# EAGLE design COM_R_UPDATED (EAGLE 9.6.2)
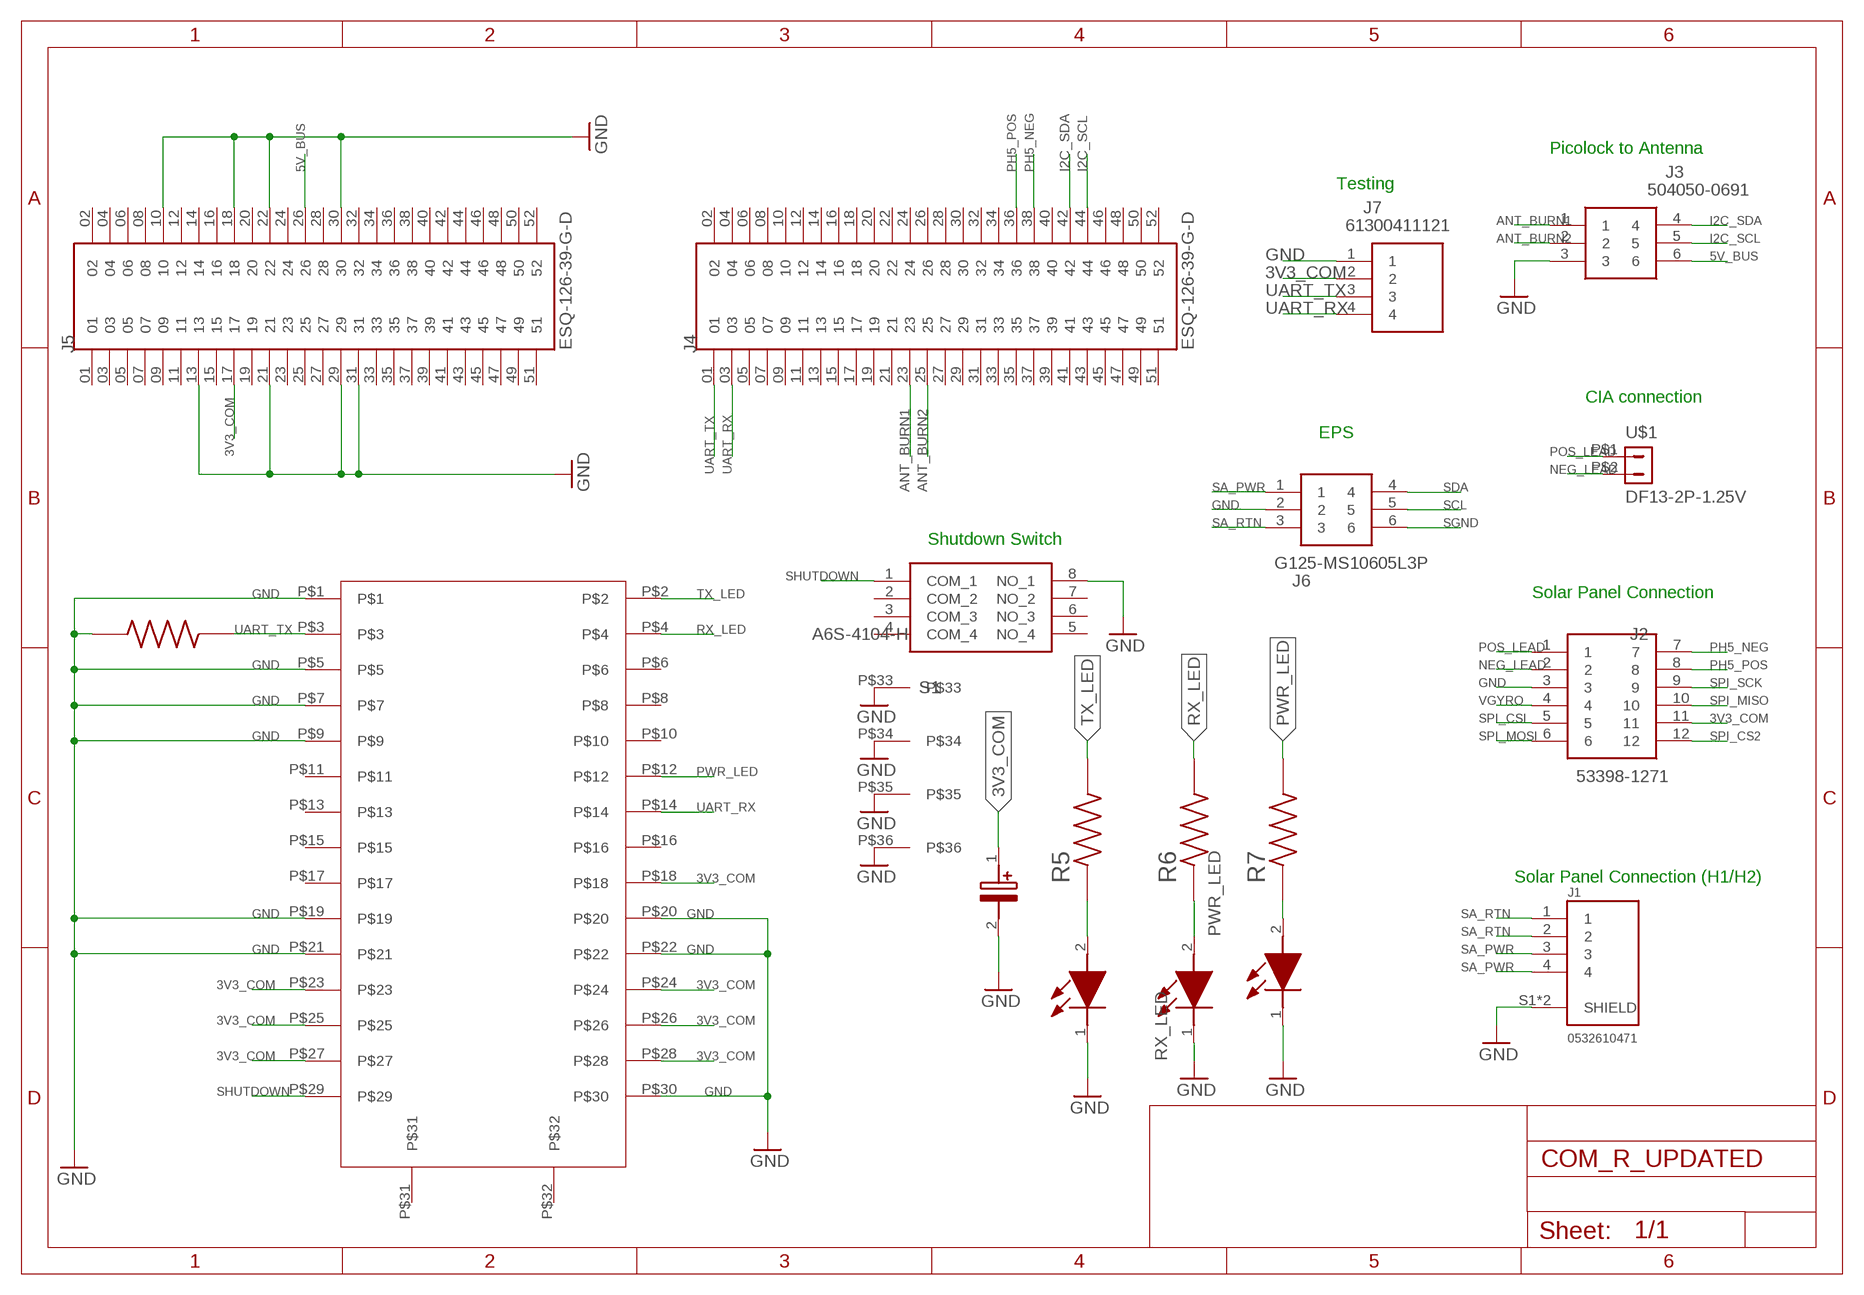
[diagram p0: schematic, sheet 1]

## Parts
C2  293D106X0010A2TE3  [CAPPM3216X180N]
J1  0532610471  [MOLEX_0532610471]
J2  53398-1271  [53398-1271]
J3  504050-0691  [504050-0691_2]
J4  ESQ-126-39-G-D  [SAMTEC_ESQ-126-39-G-D]
J5  ESQ-126-39-G-D  [SAMTEC_ESQ-126-39-G-D]
J6  G125-MS10605L3P  [G125-MS10605L3P]
J7  61300411121  [HDRV4W95P0X254_1X4_1016X254X85]
PWR_LED  HSMQ-C170-T0000  [LEDC2012X90N]
R3  TNPW080510K0BETY  [RESC2012X55N]
R5  Y40621K00000Q0R  [RESC2012X64N]
R6  Y40621K00000Q0R  [RESC2012X64N]
R7  Y40621K00000Q0R  [RESC2012X64N]
RX_LED  HSMQ-C170-T0000  [LEDC2012X90N]
S1  A6S-4104-H  [A6S4104H]
TX_LED  HSMQ-C170-T0000  [LEDC2012X90N]
U$1  DF13-2P-1.25V  [DF13C-2P-1.25V]
U$3  KYOCERA_5046_30PIN  [KYOCERA_5046_30PIN]

## Nets
3V3_COM: C2.1(+) J2.11 J5.17 J7.2 U$3.P$18 U$3.P$23 U$3.P$24 U$3.P$25 U$3.P$26 U$3.P$27 U$3.P$28
5V_BUS: J3.6 J5.26
ANT_BURN1: J3.1 J4.23
ANT_BURN2: J3.2 J4.25
GND [New Class]: C2.2(-) J1.S1(SHIELD) J1.S2(SHIELD) J2.3 J3.3 J5.10 J5.13 J5.18 J5.21 J5.22 J5.29 J5.30 J5.31 J6.2 J7.1 PWR_LED.1(K) R3.1 RX_LED.1(K) S1.8(NO_1) TX_LED.1(K) U$3.P$1 U$3.P$5 U$3.P$7 U$3.P$9 U$3.P$19 U$3.P$20 U$3.P$21 U$3.P$22 U$3.P$30 U$3.P$33 U$3.P$34 U$3.P$35 U$3.P$36
I2C_SCL: J3.5 J4.44
I2C_SDA: J3.4 J4.42
N$1: R5.1 TX_LED.2(A)
N$2: PWR_LED.2(A) R7.1
N$4: R6.1 RX_LED.2(A)
NEG_LEAD: J2.2 U$1.P$2
PH5_NEG: J2.7 J4.38
PH5_POS: J2.8 J4.36
POS_LEAD: J2.1 U$1.P$1
PWR_LED: R7.2 U$3.P$12
RX_LED: R6.2 U$3.P$4
SA_PWR: J1.3 J1.4 J6.1
SA_RTN: J1.1 J1.2 J6.3
SCL: J6.5
SDA: J6.4
SGND: J6.6
SHUTDOWN: S1.1(COM_1) U$3.P$29
SPI_CS2: J2.12
SPI_CSI: J2.5
SPI_MISO: J2.10
SPI_MOSI: J2.6
SPI_SCK: J2.9
TX_LED: R5.2 U$3.P$2
UART_RX: J4.03 J7.4 U$3.P$14
UART_TX: J4.01 J7.3 R3.2 U$3.P$3
VGYRO: J2.4
Unconnected: J4.02 J4.04 J4.05 J4.06 J4.07 J4.08 J4.09 J4.10 J4.11 J4.12 J4.13 J4.14 J4.15 J4.16 J4.17 J4.18 J4.19 J4.20 J4.21 J4.22 J4.24 J4.26 J4.27 J4.28 J4.29 J4.30 J4.31 J4.32 J4.33 J4.34 J4.35 J4.37 J4.39 J4.40 J4.41 J4.43 J4.45 J4.46 J4.47 J4.48 J4.49 J4.50 J4.51 J4.52 J5.01 J5.02 J5.03 J5.04 J5.05 J5.06 J5.07 J5.08 J5.09 J5.11 J5.12 J5.14 J5.15 J5.16 J5.19 J5.20 J5.23 J5.24 J5.25 J5.27 J5.28 J5.32 J5.33 J5.34 J5.35 J5.36 J5.37 J5.38 J5.39 J5.40 J5.41 J5.42 J5.43 J5.44 J5.45 J5.46 J5.47 J5.48 J5.49 J5.50 J5.51 J5.52 S1.2(COM_2) S1.3(COM_3) S1.4(COM_4) S1.5(NO_4) S1.6(NO_3) S1.7(NO_2) U$3.P$6 U$3.P$8 U$3.P$10 U$3.P$11 U$3.P$13 U$3.P$15 U$3.P$16 U$3.P$17 U$3.P$31 U$3.P$32

## Notes on the sheet
- Picolock to Antenna
- Testing
- CIA connection
- EPS
- Shutdown Switch
- Solar Panel Connection
- Solar Panel Connection (H1/H2)

## Library data of the parts
C2 = SamacSys_Parts:293D106X0010A2TE3: Solid Tantalum Surface Mount Chip Capacitors TANTAMOUNT(TM), Molded Case, Standard Industrial Grade Source: Datasheet <https://componentsearchengine.com/Datasheets/1/293D106X0010A2TE3.pdf>; DESCRIPTION: Solid Tantalum Surface Mount Chip Capacitors TANTAMOUNT(TM), Molded Case, Standard Industrial Grade; HEIGHT: 1.8mm; MANUFACTURER_NAME: Vishay; MANUFACTURER_PART_NUMBER: 293D106X0010A2TE3; MOUSER_PART_NUMBER: 74-293D106X0010A2TE3; MOUSER_PRICE-STOCK: https://www.mouser.com/Search/Refine.aspx?Keyword=74-293D106X0010A2TE3
J1 = 0532610471:0532610471: Conn Shrouded Header HDR 4 POS 1.25mm Solder RA SMD PicoBlade™ Embossed T/R; AVAILABILITY: Unavailable; DESCRIPTION: Picoblade Connector, 4 Circuit Single Row, Right Angle Surface Mount SMT PCB; DIGIKEY-PURCHASE-URL: https://snapeda.com/shop?store=DigiKey&id=542805; MF: Molex; MP: 0532610471; PACKAGE: None; PRICE: None
J2 = SamacSys_Parts:53398-1271: 12 way SMT straight header Molex PICOBLADE Series, Series Number 53398, 1.25mm Pitch 12 Way 1 Row Shrouded Straight PCB Header, Surface Mount Source: Datasheet <https://componentsearchengine.com/Datasheets/1/53398-1271.pdf>; DESCRIPTION: 12 way SMT straight header Molex PICOBLADE Series, Series Number 53398, 1.25mm Pitch 12 Way 1 Row Shrouded Straight PCB Header, Surface Mount; HEIGHT: mm; MANUFACTURER_NAME: Molex; MANUFACTURER_PART_NUMBER: 53398-1271; MOUSER_PART_NUMBER: 538-53398-1271; MOUSER_PRICE-STOCK: https://www.mouser.com/Search/Refine.aspx?Keyword=538-53398-1271
J3 = SamacSys_Parts:504050-0691: Pico-Lock SMT Wire-to-Board Header 6 way Molex Pico-Lock Series, Series Number 504050, 1.5mm Pitch 6 Way 1 Row Shrouded Right Angle PCB Header, Surface Mount Source: Datasheet <https://componentsearchengine.com/Datasheets/2/504050-0691.pdfhttp://www.molex.com/pdm_docs/sd/5040500691_sd.pdf>; DESCRIPTION: Pico-Lock SMT Wire-to-Board Header 6 way Molex Pico-Lock Series, Series Number 504050, 1.5mm Pitch 6 Way 1 Row Shrouded Right Angle PCB Header, Surface Mount; HEIGHT: mm; MANUFACTURER_NAME: Molex; MANUFACTURER_PART_NUMBER: 504050-0691; MOUSER_PART_NUMBER: 538-504050-0691; MOUSER_PRICE-STOCK: https://www.mouser.co.uk/ProductDetail/Molex/504050-0691?qs=bvCPb%252BE7ys2K1LQC9e%2FvRg%3D%3D
J4 J5 = ESQ-126-39-G-D:ESQ-126-39-G-D; AVAILABILITY: Unavailable; DESCRIPTION: 52 Position Elevated Socket Connector Through Hole; MF: Samtec; MP: ESQ-126-39-G-D; PACKAGE: None; PRICE: None; TOBY_UK-PURCHASE-URL: https://snapeda.com/shop?store=Toby+UK&id=490181
J6 = SamacSys_Parts:G125-MS10605L3P: Gecko DIL Male Vertical Surface Mount Connector, SMT Latches, gold, pick & place (cut tape packing), 6 contacts Source: Datasheet <https://componentsearchengine.com/Datasheets/1/G125-MS10605L3P.pdf>; DESCRIPTION: Gecko DIL Male Vertical Surface Mount Connector, SMT Latches, gold, pick &amp; place (cut tape packing), 6 contacts; HEIGHT: 4.9mm; MANUFACTURER_NAME: Harwin; MANUFACTURER_PART_NUMBER: G125-MS10605L3P; MOUSER_PART_NUMBER: 855-G125-MS10605L3P; MOUSER_PRICE-STOCK: https://www.mouser.com/Search/Refine.aspx?Keyword=855-G125-MS10605L3P
J7 = SamacSys_Parts:61300411121: WR-PHD 2.54mm Pin Header THT Straight 4p Wurth Elektronik WR-PHD Series, Series Number 6130, 2.54mm Pitch 4 Way 1 Row Straight PCB Header, Solder Termination Source: Datasheet <http://katalog.we-online.de/em/datasheet/6130xx11121.pdf>; DESCRIPTION: WR-PHD 2.54mm Pin Header THT Straight 4p Wurth Elektronik WR-PHD Series, Series Number 6130, 2.54mm Pitch 4 Way 1 Row Straight PCB Header, Solder Termination; HEIGHT: 8.54mm; MANUFACTURER_NAME: Wurth Elektronik; MANUFACTURER_PART_NUMBER: 61300411121; MOUSER_PART_NUMBER: 710-61300411121; MOUSER_PRICE-STOCK: https://www.mouser.co.uk/ProductDetail/Wurth-Elektronik/61300411121?qs=PhR8RmCirEYQcLLqXD8rAA%3D%3D
PWR_LED RX_LED TX_LED = SamacSys_Parts:HSMQ-C170-T0000: CHIP,TOP MT,INGAN,GRN - Bulk Source: Datasheet <https://docs.broadcom.com/docs/HSMQ-C170-T0000-DS100>; DESCRIPTION: CHIP,TOP MT,INGAN,GRN - Bulk; HEIGHT: 0.9mm; MANUFACTURER_NAME: Avago Technologies; MANUFACTURER_PART_NUMBER: HSMQ-C170-T0000; MOUSER_PART_NUMBER: 630-HSMQ-C170-T0000; MOUSER_PRICE-STOCK: https://www.mouser.co.uk/ProductDetail/Broadcom-Avago/HSMQ-C170-T0000?qs=Mv7BduZupUglySblHICXPQ%3D%3D
R3 = TNPW080510K0BETY:TNPW080510K0BETY: TNPW, 0805, 10 kOhm, 0.1%, 25 ppm; DESCRIPTION: 10 kOhms ±0.1% 0.125W, 1/8W Chip Resistor 0805 (2012 Metric) Thin Film; DIGI-KEY_PART_NUMBER: 541-3913-1-ND; MF: Vishay; MP: TNPW080510K0BETY; PACKAGE: 2012 Vishay; PURCHASE-URL: https://pricing.snapeda.com/search/part/TNPW080510K0BETY/?ref=eda
R5-R7 = Y40621K00000Q0R:Y40621K00000Q0R; DESCRIPTION: 1 kOhms ±0.02% 0.3W Chip Resistor 0805 (2012 Metric) Moisture Resistant, Non-Inductive Metal Foil; DIGI-KEY_PART_NUMBER: Y4062-1.0KACT-ND; MF: Vishay; MP: Y40621K00000Q0R; PACKAGE: 2012 Vishay; PURCHASE-URL: https://pricing.snapeda.com/search/part/Y40621K00000Q0R/?ref=eda
S1 = SamacSys_Parts:A6S-4104-H: 4 Way Surface Mount DIP Switch 4P Source: Datasheet <https://componentsearchengine.com/Datasheets/1/A6S-4104-H.pdf>; DESCRIPTION: 4 Way Surface Mount DIP Switch 4P; HEIGHT: mm; MANUFACTURER_NAME: Omron Electronics; MANUFACTURER_PART_NUMBER: A6S-4104-H; MOUSER_PART_NUMBER: 653-A6S-4104-H; MOUSER_PRICE-STOCK: https://www.mouser.co.uk/ProductDetail/Omron-Electronics/A6S-4104-H?qs=ZP3UR5XsUocSmJ29mwneiw%3D%3D
U$1 = con-hirose-df13:DF13-2P-1.25: DF13-2P 1.25mm Pitch Miniature Crimping Connector.
U$3 = XDLradioConnectorBreakout:KYOCERA_5046_30PIN

## Board
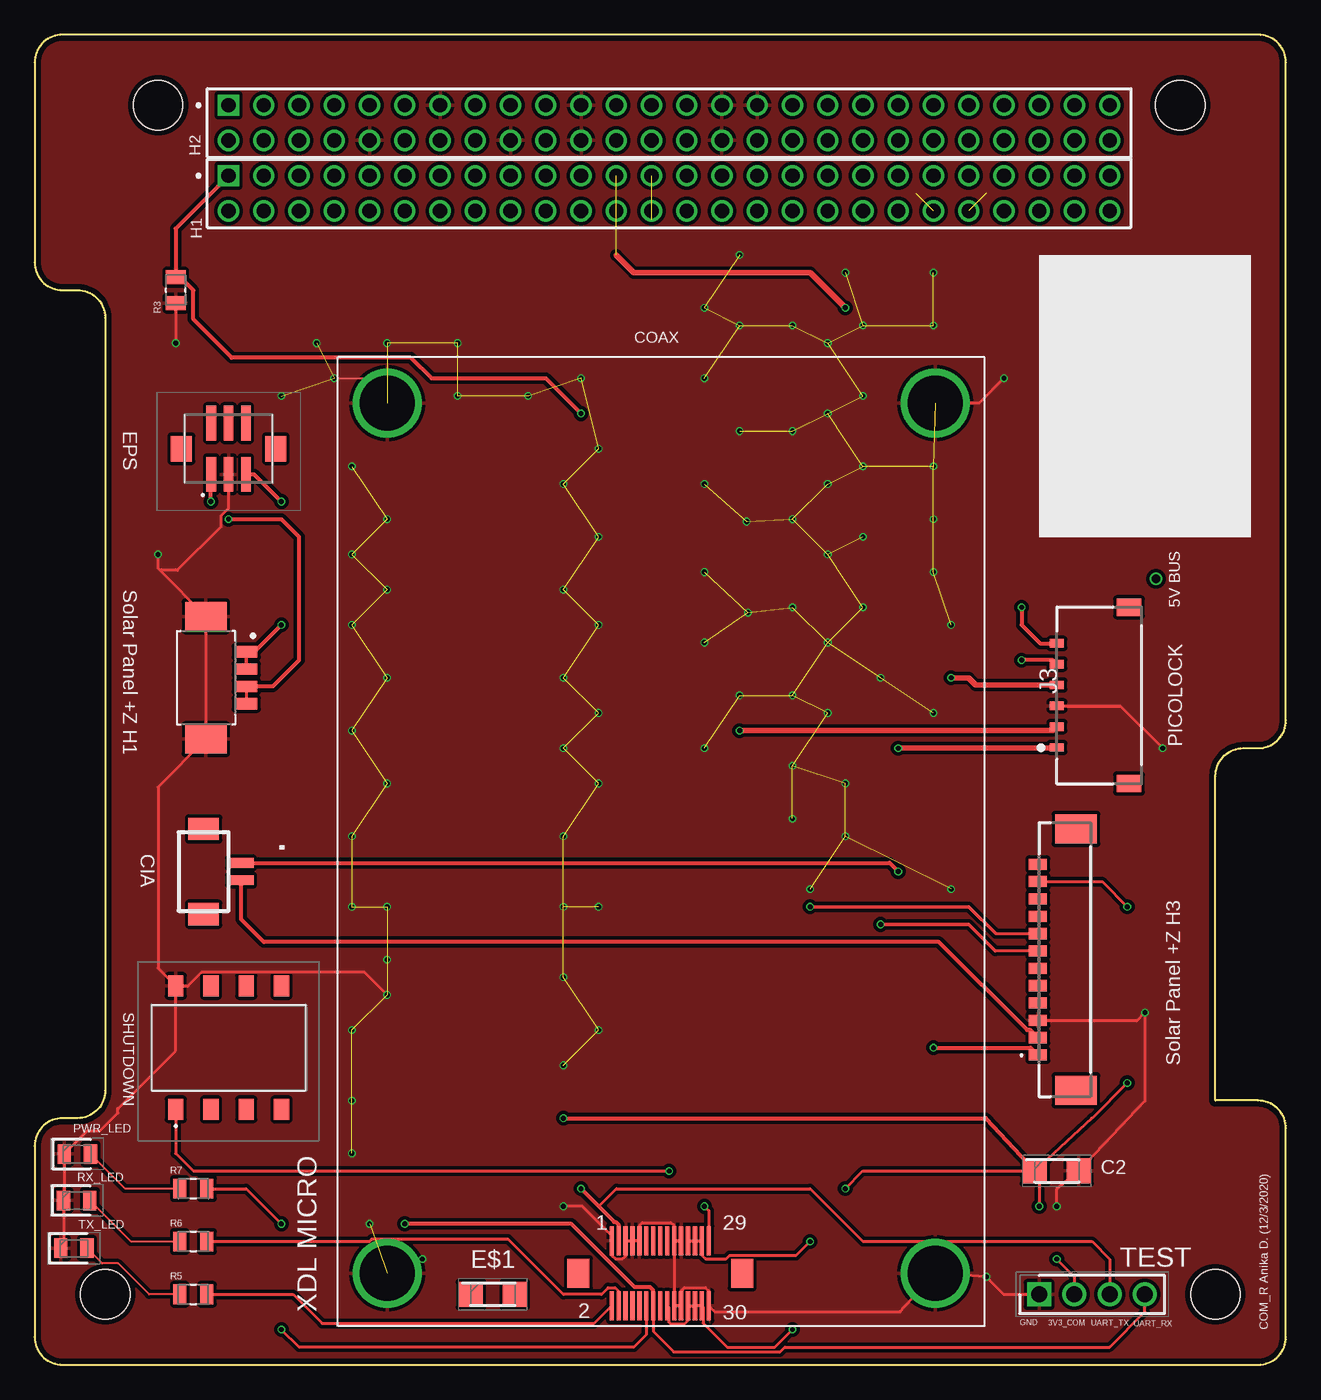
[diagram p1: board, top side]
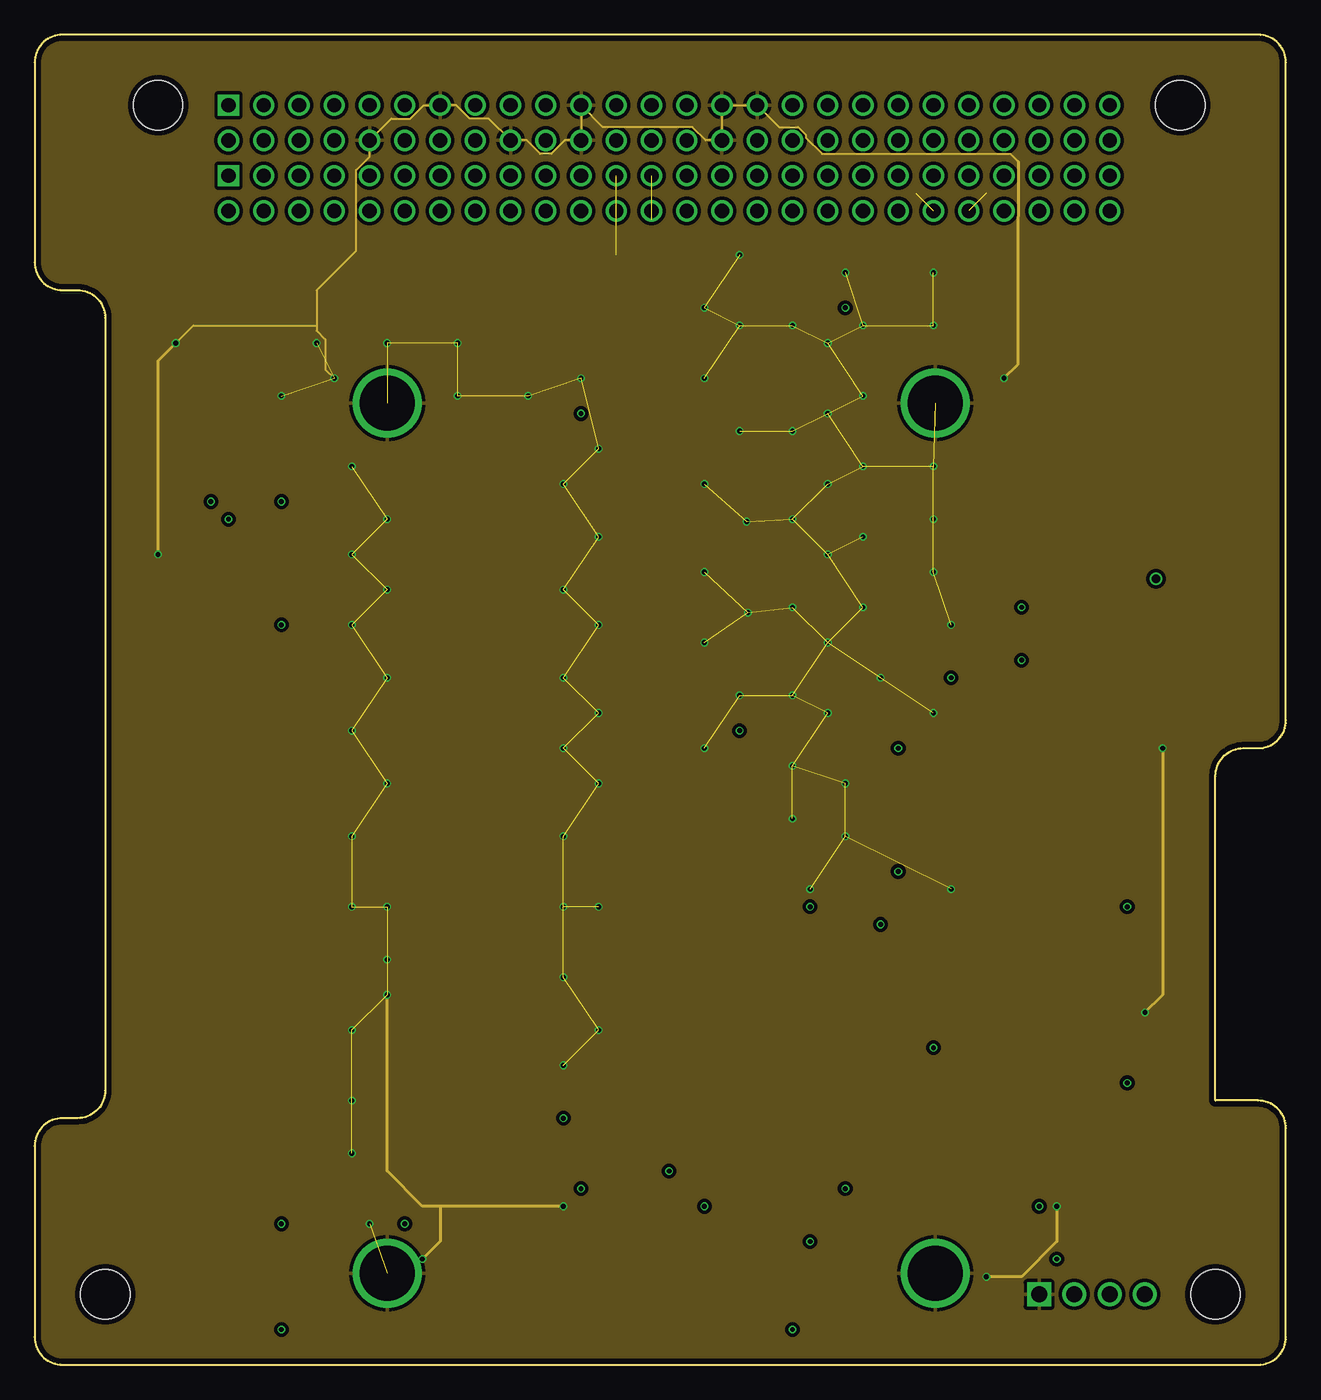
[diagram p2: board, inner layer Route2]
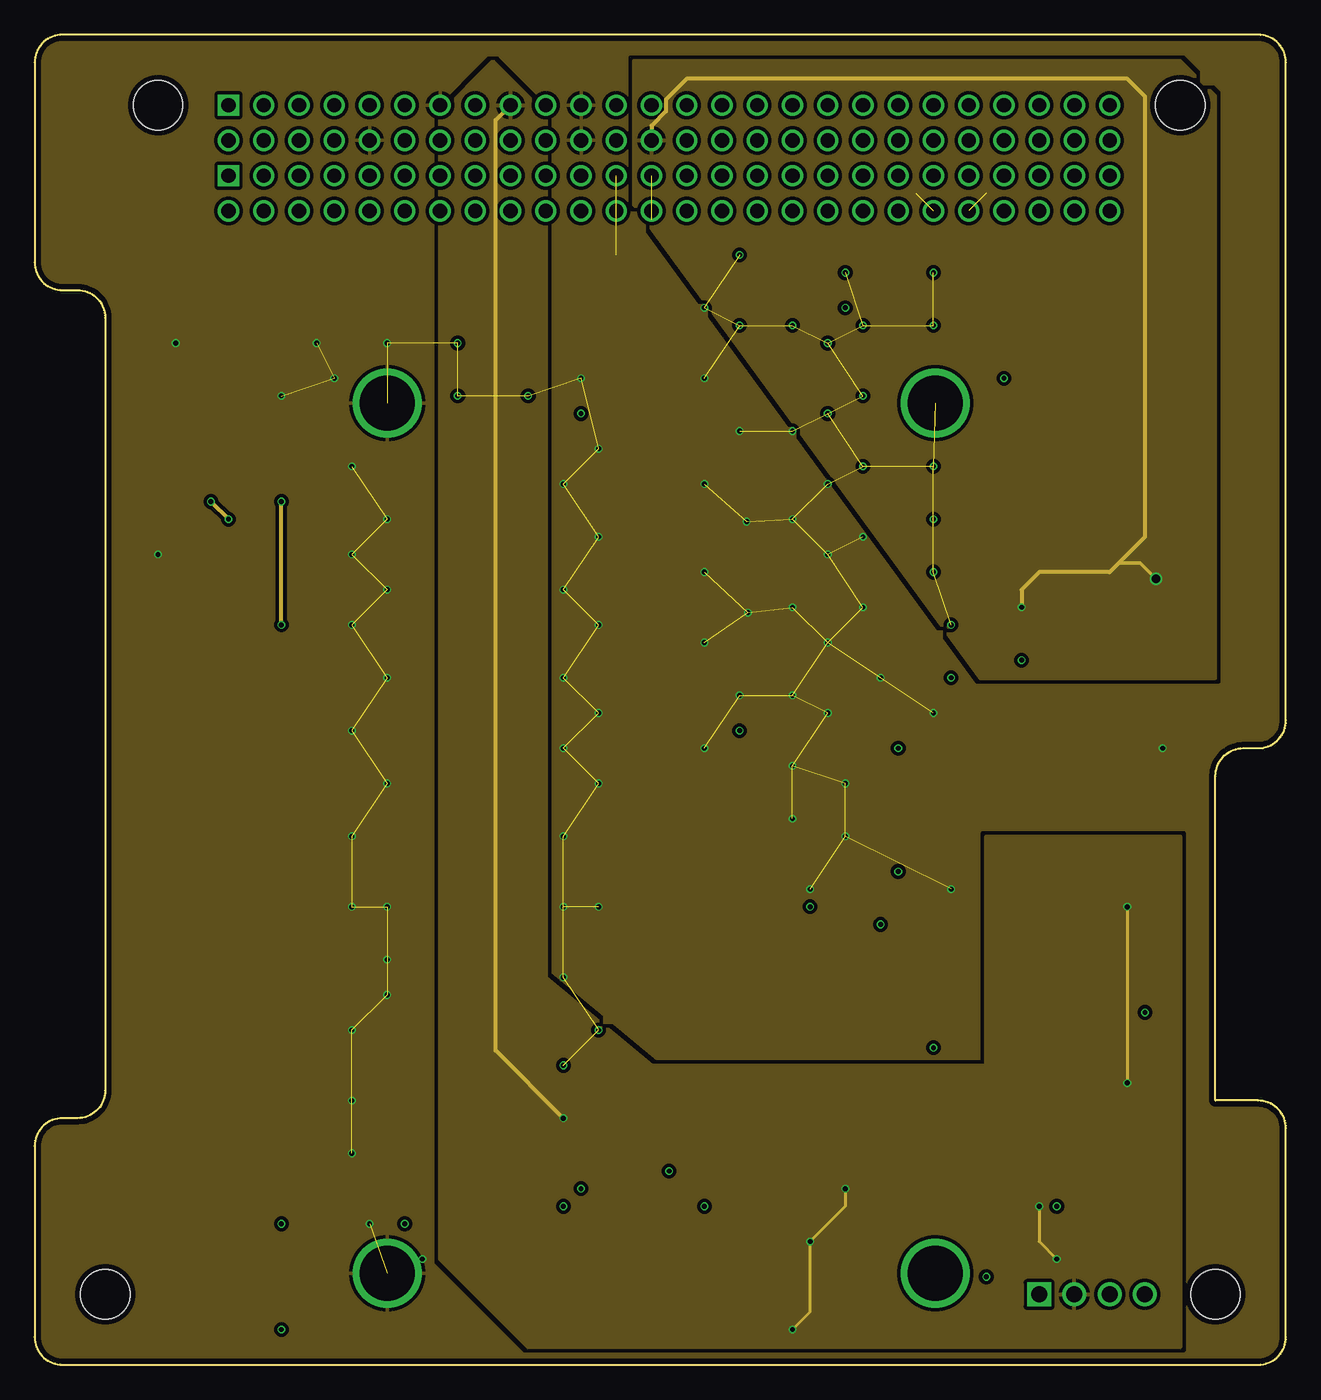
[diagram p3: board, inner layer Route15]
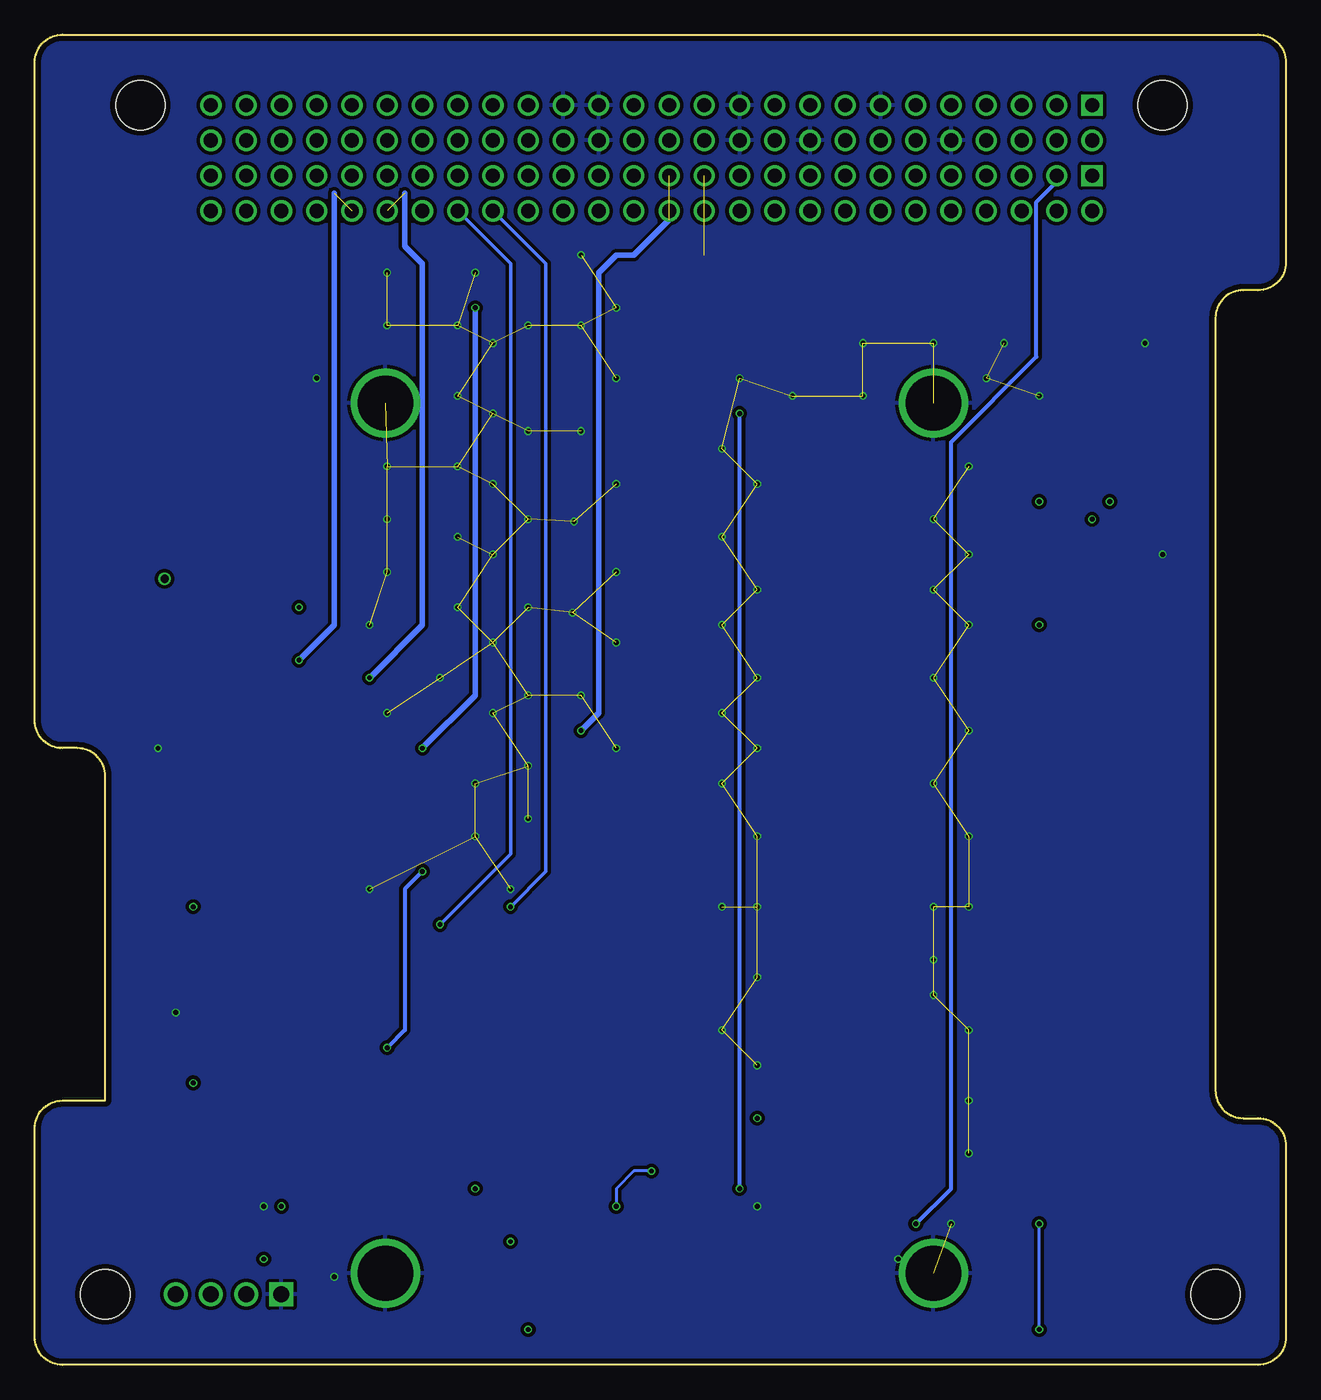
[diagram p4: board, bottom side, seen from below]

Size 90.17 x 95.89 mm. Coordinates in mm from the lower left corner, seen from the top.
Outline: 0,15.78 0,2 arc90 2,0 88.17,0 arc90 90.17,2 90.17,17.05 arc90 88.17,19.05 85.09,19.05 85.09,42.45 arc-90 87.09,44.45 88.17,44.45 arc90 90.17,46.45 90.17,93.89 arc90 88.17,95.89 2,95.89 arc90 0,93.89 0,79.47 arc90 2,77.47 3.08,77.47 arc-90 5.08,75.47 5.08,19.78 arc-90 3.08,17.78 2,17.78 arc90 0,15.78
Copper layers (1*2*15*16): Top 0.035559375mm / dielectric 0.17018125mm / Route2 0.01778125mm / dielectric 47mil / Route15 0.01778125mm / dielectric 0.17018125mm / Bottom 0.035559375mm
Design rules "oshpark-4layer *": minimum track width 5mil, minimum drill 10mil, track to track 5mil, track to pad 5mil, pad to pad 5mil, via to via 5mil, smd to smd 5mil, copper to edge 15mil, drill to drill 6mil, minimum pad ring 4mil, minimum via ring 4mil, stop-mask expansion 1.5mil, vias tented up to drill 20mil, thermal gap 10mil
Holes 3.56 mm at 82.55,90.81 8.89,90.81 5.08,5.08 85.09,5.08

### Footprints (pad centres in the part's own frame; a part is rotated, then mirrored left to right if it is on the bottom)
CAPPM3216X180N = smd 1.7 x 1.8: 1 -1.575,0; 2 1.575,0
MOLEX_0532610471 = smd 0.8 x 1.6: 1 -1.875,0; 2 -0.625,0; 3 0.625,0; 4 1.875,0 | smd 2.1 x 3: S1 -4.425,-2.9; S2 4.425,-2.9
53398-1271 = smd 0.8 x 1.3: 1 -6.875,0.1; 2 -5.625,0.1; 3 -4.375,0.1; 4 -3.125,0.1; 5 -1.875,0.1; 6 -0.625,0.1; 7 0.625,0.1; 8 1.875,0.1; 9 3.125,0.1; 10 4.375,0.1; 11 5.625,0.1; 12 6.875,0.1 | smd 2.1 x 3: 13 -9.425,-2.65; 14 9.425,-2.65
504050-0691_2 = smd 0.6 x 1: 1 3.75,0; 2 2.25,0; 3 0.75,0; 4 -0.75,0; 5 -2.25,0; 6 -3.75,0 | smd 1.25 x 1.8: 7 -6.355,5.2; 8 6.355,5.2
SAMTEC_ESQ-126-39-G-D = drill 1.02 pad 1.37 square: 01 0,0 | drill 1.02 pad 1.37: 02 0,2.54; 03 -2.54,0; 04 -2.54,2.54; 05 -5.08,0; 06 -5.08,2.54; 07 -7.62,0; 08 -7.62,2.54; 09 -10.16,0; 10 -10.16,2.54; 11 -12.7,0; 12 -12.7,2.54; 13 -15.24,0; 14 -15.24,2.54; 15 -17.78,0; 16 -17.78,2.54; 17 -20.32,0; 18 -20.32,2.54; 19 -22.86,0; 20 -22.86,2.54; 21 -25.4,0; 22 -25.4,2.54; 23 -27.94,0; 24 -27.94,2.54; 25 -30.48,0; 26 -30.48,2.54; 27 -33.02,0; 28 -33.02,2.54; 29 -35.56,0; 30 -35.56,2.54; 31 -38.1,0; 32 -38.1,2.54; 33 -40.64,0; 34 -40.64,2.54; 35 -43.18,0; 36 -43.18,2.54; 37 -45.72,0; 38 -45.72,2.54; 39 -48.26,0; 40 -48.26,2.54; 41 -50.8,0; 42 -50.8,2.54; 43 -53.34,0; 44 -53.34,2.54; 45 -55.88,0; 46 -55.88,2.54; 47 -58.42,0; 48 -58.42,2.54; 49 -60.96,0; 50 -60.96,2.54; 51 -63.5,0; 52 -63.5,2.54
G125-MS10605L3P = smd 0.7 x 2.5: 1 -1.25,-1.85; 2 0,-1.85; 3 1.25,-1.85; 4 -1.25,1.85; 5 0,1.85; 6 1.25,1.85 | smd 1.5 x 1.85: 7 -3.4,0; 8 3.4,0
HDRV4W95P0X254_1X4_1016X254X85 = drill 1.15 pad 1.725 square: 1 0,0 | drill 1.15 pad 1.725: 2 2.54,0; 3 5.08,0; 4 7.62,0
LEDC2012X90N = smd 0.95 x 1.4: 1 -0.95,0; 2 0.95,0
RESC2012X55N = smd 1 x 1.42: 1 -0.935,0; 2 0.935,0
RESC2012X64N = smd 0.93 x 1.42: 1 -0.979,0; 2 0.979,0
A6S4104H = smd 1.1 x 1.5: 1 -3.81,-4.45; 2 -1.27,-4.45; 3 1.27,-4.45; 4 3.81,-4.45; 5 3.81,4.45; 6 1.27,4.45; 7 -1.27,4.45; 8 -3.81,4.45
DF13C-2P-1.25V = smd 1.6 x 2.2: M$0 3.075,-1.8; M$1 -3.075,-1.8 | smd 0.7 x 1.8: P$1 -0.625,0.9; P$2 0.625,0.9
KYOCERA_5046_30PIN = smd 0.3 x 2.1: P$1 3.5,-2.35; P$2 3.5,2.35; P$3 3,-2.35; P$4 3,2.35; P$5 2.5,-2.35; P$6 2.5,2.35; P$7 2,-2.35; P$8 2,2.35; P$9 1.5,-2.35; P$10 1.5,2.35; P$11 1,-2.35; P$12 1,2.35; P$13 0.5,-2.35; P$14 0.5,2.35; P$15 0,-2.35; P$16 0,2.35; P$17 -0.5,-2.35; P$18 -0.5,2.35; P$19 -1,-2.35; P$20 -1,2.35; P$21 -1.5,-2.35; P$22 -1.5,2.35; P$23 -2,-2.35; P$24 -2,2.35; P$25 -2.5,-2.35; P$26 -2.5,2.35; P$27 -3,-2.35; P$28 -3,2.35; P$29 -3.5,-2.35; P$30 -3.5,2.35 | smd 1.6 x 2.1: P$31 5.9,0; P$32 -5.9,0 | drill 3.969: P$33 -19.81,0; P$34 19.68,0; P$35 -19.81,-62.74; P$36 19.68,-62.74

### Placement (x,y rotation side)
C2  73.66,13.97 0 top
E$1  [CAPPM3216X180N]  33.02,5.08 0 top
J1  15.24,49.53 270 top
J2  72.39,29.21 90 top
J3  73.66,48.26 270 top
J4  13.97,85.72 180 top
J5  13.97,90.81 180 top
J6  13.97,66.04 0 top
J7  72.39,5.08 0 top
PWR_LED  3.07,15.2 0 top
R3  10.16,77.47 90 top
R5  11.43,5.08 0 top
R6  11.43,8.89 0 top
R7  11.43,12.7 0 top
RX_LED  3.03,11.85 0 top
S1  13.97,22.86 0 top
TX_LED  2.82,8.4 0 top
U$1  13.97,35.56 270 top
U$3  45.08,6.6 180 top

### Tracks (layer width: path | path; a pad name or v marks a point on that pad's centre or on a via)
3V3_COM  (via drill 0.35)
  Top 0.152: U$3.P$27 48.11,8.92
  Top 0.2: 76.92,34.84 v78.74,33.02
  Top 0.203: C2.1 76.17,17.78 76.2,17.78 v78.74,20.32 | v72.39,11.43 72.39,13.94 C2.1 | v73.66,7.62 74.93,6.35 J7.2 | U$3.P$18 45.68,4.15 45.68,3.1 45.83,2.95 46.84,2.95 47.03,3.14 47.03,4.2 U$3.P$24 U$3.P$26 U$3.P$28 48.18,4.15 48.18,3 49.9,1.27 53.34,1.27 v54.61,2.54 | v58.42,12.7 59.69,13.97 C2.1 | v55.88,8.89 54.87,7.88 50.09,7.88 49.85,7.65 48.33,7.65 48.11,7.86 48.11,8.92 | J2.11 76.92,34.84 | U$3.P$23 U$3.P$25 U$3.P$27
  Top 0.305: v38.1,17.78 68.55,17.78 C2.1
  Route15 0.203: v78.74,33.02 v78.74,20.32 | v72.39,11.43 72.39,8.89 v73.66,7.62 | v54.61,2.54 55.88,3.81 v55.88,8.89 58.42,11.43 v58.42,12.7
  Route15 0.305: v38.1,17.78 33.22,22.66 33.22,89.73 J5.17
  pour Route15 (isolate 0.254): 29.21,7.62 29.21,90.17 33.02,93.98 36.83,90.17 36.83,27.94 44.45,21.59 68.58,21.59 68.58,38.1 82.55,38.1 82.55,1.27 35.56,1.27
5V_BUS  (via drill 0.35, 0.6)
  Top 0.305: v71.12,54.61 71.12,53.34 72.45,52.01 J3.6
  Route15 0.254: 78.11,57.78 78.74,57.78 78.87,57.78 79.68,57.78 v80.8,56.67
  Route15 0.305: v71.12,54.61 71.12,55.88 72.39,57.15 77.47,57.15 78.11,57.78 80.01,59.69 80.01,91.44 78.74,92.71 46.99,92.71 45.49,91.21 45.49,90.37 44.45,89.33 J5.26
  pour Route15 (isolate 0.254, rank 2): 43.18,93.98 43.18,83.63 68.11,49.53 85.09,49.53 85.09,91.44 82.55,93.98
ANT_BURN1  (via drill 0.35)  (1 unrouted)
  Top 0.406: 41.91,80.01 43.18,78.74 55.88,78.74 v58.42,76.2 | v62.23,44.45 73.6,44.45 J3.1
  Bottom 0.406: v62.23,44.45 58.42,48.26 v58.42,76.2
ANT_BURN2  (via drill 0.35)  (1 unrouted)
  Top 0.406: J3.2 73.37,45.72 v50.8,45.72
  Bottom 0.406: 44.45,82.55 46.99,80.01 48.26,80.01 49.53,78.74 49.53,46.99 v50.8,45.72
GND  (via drill 0.35)  (81 unrouted)
  Top 0.152: v21.59,71.12 23.62,71.12 U$3.P$36
  Top 0.2: 8.89,57.41 v8.89,58.42
  Top 0.203: U$3.P$19 U$3.P$21 | U$3.P$19 46.08,10.01 45.84,10.25 43.83,10.25 43.58,10.01 U$3.P$9 U$3.P$7 U$3.P$5 42.58,7.85 42.37,7.65 41.83,7.65 41.59,7.88 41.59,8.94 U$3.P$1 41.58,9.3 39.45,11.43 v38.1,11.43 | U$3.P$19 | 9.02,57.28 J1.S1 J1.S2 8.89,41.66 8.89,28.58 S1.8 | 9.02,57.28 8.89,57.41 | J3.3 78.22,47.51 v81.28,44.45 | J2.3 79.44,24.84 v80.01,25.4 80.01,19.02 C2.2 73.66,12.67 v73.66,11.43 | S1.8 10.16,22.64 6.01,18.49 5.99,18.43 5.99,18.15 4.68,16.85 3.78,16.85 PWR_LED.1 2.12,11.89 RX_LED.1 2.08,8.61 TX_LED.1 | S1.8 11.04,27.31 12.04,28.31 23.76,28.31 v25.4,26.67 | U$3.P$19 U$3.P$20 U$3.P$22 46.58,5.31 46.83,5.55 48.34,5.55 48.58,5.31 U$3.P$30 49.02,3.81 62.35,3.81 U$3.P$33 v68.58,6.35 69.85,5.08 J7.1 | v27.94,7.62 26.67,6.35 U$3.P$34 | v69.85,71.12 68.07,69.34 U$3.P$35 | 9.02,57.28 10.29,57.28 13.41,60.4 13.41,61.19 13.97,61.75 J6.2 | R3.1 v10.16,73.66
  Route2 0.152: 20.32,74.93 20.32,77.47 23.16,80.31 23.16,86.13 24.13,87.09 J5.10 25.7,89.84 27.07,89.84 28.04,90.81 J5.13 30.38,90.81 31.35,89.84 32.72,89.84 J5.18 35.46,88.27 36.43,87.3 37.23,87.3 38.2,88.27 J5.22 J5.21 40.94,89.23 47.39,89.23 48.36,88.27 J5.30 J5.29 J5.31 53.64,89.23 55.01,89.23 55.58,88.67 55.58,88.47 56.75,87.3 70.32,87.3 70.87,86.74 | 20.32,74.93 20.32,74.55 20.95,73.92 20.95,71.76 v21.59,71.12 | v10.16,73.66 11.43,74.93 20.32,74.93
  Route2 0.203: v81.28,44.45 81.28,26.67 v80.01,25.4 | v38.1,11.43 29.21,11.43 | 29.21,11.43 27.94,11.43 25.4,13.97 v25.4,26.67 | 29.21,11.43 29.21,8.89 v27.94,7.62 | v69.85,71.12 70.84,72.11 70.84,82.74 70.87,82.76 70.87,86.74 | v73.66,11.43 73.66,8.89 71.12,6.35 v68.58,6.35 | v8.89,58.42 8.89,72.39 v10.16,73.66
  other vias: 30.48,73.66 38.1,63.5 38.1,55.88 50.8,67.31 48.26,71.12 48.26,63.5 48.26,57.15 48.26,52.07 51.4,54.22 48.26,44.45 40.64,46.99 40.64,53.34 38.1,49.53 40.64,59.69 40.64,66.04 38.1,44.45 40.64,41.91 51.31,60.79 54.61,60.96 57.15,58.42 54.61,54.61 57.15,52.07 50.8,48.26 54.61,48.26 22.86,64.77 25.4,55.88 22.86,53.34 22.86,45.72 38.1,38.1 54.61,43.18 54.61,39.37 58.42,41.91 58.42,38.1 66.04,34.29 59.69,59.69 57.15,63.5 54.61,67.31 60.96,49.53 57.15,46.99 64.77,46.99 59.69,54.61 66.04,53.34 64.77,57.15 64.77,60.96 59.69,64.77 57.15,68.58 59.69,69.85 64.77,64.77 57.15,73.66 54.61,74.93 50.8,74.93 22.86,38.1 25.4,41.91 22.86,33.02 22.86,24.13 25.4,33.02 25.4,29.21 22.86,19.05 38.1,21.59 38.1,27.94 40.64,24.13 40.64,33.02 38.1,33.02 25.4,60.96 22.86,58.42 22.86,15.24 24.13,10.16 20.32,73.66 17.78,69.85 25.4,73.66 35.56,69.85 39.37,71.12 30.48,69.85 50.8,80.01 58.42,78.74 64.77,78.74 59.69,74.93 64.77,74.93 48.26,76.2 55.88,34.29 25.4,49.53
  pour Top (isolate 0.254): -3.81,97.79 -3.81,-1.71 arc45 -3.22,-3.13 -1.27,-5.08 90.61,-5.08 arc45 92.03,-4.49 95.25,-1.27 95.25,93.15 arc45 94.66,94.57 90.17,99.06 -1.71,99.06 arc45 -3.13,98.47
  pour Route2 (isolate 0.254): -2.54,99.06 -2.54,-3.81 -1.27,-5.08 92.71,-5.08 93.98,-3.81 93.98,96.52 92.71,97.79 -1.27,97.79
  pour Bottom (isolate 0.254): -1.27,95.25 0,93.98 0,-2.54 91.44,-2.54 92.71,-1.27 92.71,95.25 91.44,96.52 0,96.52
  pour Route15 (isolate 0.254, rank 3): 87.63,96.52 0,96.52 -1.27,95.25 -1.27,77.47 0,76.2 3.81,76.2 3.81,19.05 2.54,17.78 -1.27,17.78 -1.27,0 91.44,0 91.44,17.78 90.17,19.05 86.36,19.05 86.36,43.18 88.9,43.18 91.44,45.72 91.44,93.98 88.9,96.52
I2C_SCL  (via drill 0.35)  (1 unrouted)
  Top 0.203: J3.5 73.37,50.8
  Top 0.305: 73.37,50.8 v71.12,50.8
  Bottom 0.406: v71.12,50.8 68.58,53.34 68.58,84.45
I2C_SDA  (via drill 0.35)  (1 unrouted)
  Top 0.406: v66.04,49.53 67.31,49.53 67.83,49.01 J3.4
  Bottom 0.406: v66.04,49.53 62.23,53.34 62.23,79.38 63.5,80.64 63.5,84.45
N$1
  Top 0.152: TX_LED.2 4.86,7.32 6.01,7.32 8.24,5.08 R5.1
N$2
  Top 0.152: R7.1 6.52,12.7 PWR_LED.2
N$4
  Top 0.152: RX_LED.2 6.93,8.89 R6.1
NEG_LEAD
  Top 0.305: J2.2 71.75,24.13 71.51,24.13 65.16,30.48 16.51,30.48 14.87,32.12 U$1.P$2
PH5_NEG  (via drill 0.35)
  Top 0.203: J2.7 69.22,29.84
  Top 0.254: 69.22,29.84 67.31,31.75 v60.96,31.75
  Bottom 0.254: J4.38 55.88,79.38 55.88,36.83 v60.96,31.75
PH5_POS  (via drill 0.35)
  Top 0.203: 69.25,31.09 J2.8
  Top 0.254: v55.88,33.02 67.31,33.02 69.25,31.09
  Bottom 0.254: J4.36 53.34,79.38 53.34,35.56 v55.88,33.02
POS_LEAD  (via drill 0.35)
  Top 0.305: v64.77,22.86 71.77,22.86 J2.1 | U$1.P$1 61.6,36.19 v62.23,35.56
  Bottom 0.305: v62.23,35.56 63.5,34.29 63.5,24.13 v64.77,22.86
PWR_LED  (via drill 0.35)
  Top 0.203: v17.78,2.54 19.05,1.27 43.18,1.27 44.08,2.17 U$3.P$12 | R7.2 15.24,12.7 v17.78,10.16
  Bottom 0.203: v17.78,2.54 v17.78,10.16
RX_LED
  Top 0.203: U$3.P$4 42.08,5.31 41.84,5.55 41.33,5.55 40.85,5.08 38.1,5.08 34.12,9.06 24.28,9.06 24.11,8.89 R6.2
SA_PWR  (via drill 0.35)
  Top 0.203: J1.3 J1.4
  Top 0.305: J1.3 17.16,48.91 19.05,50.8 19.05,59.69 17.78,60.96 v13.97,60.96 | v12.7,62.23 12.7,64.17 J6.1
  Route15 0.305: v12.7,62.23 v13.97,60.96
SA_RTN  (via drill 0.35)
  Top 0.203: 15.85,51.41 J1.1
  Top 0.254: J1.1 J1.2
  Top 0.305: v17.78,53.34 15.85,51.41 | v17.78,62.23 15.82,64.19 J6.3
  Route15 0.305: v17.78,53.34 v17.78,62.23
SHUTDOWN  (via drill 0.35)
  Top 0.203: S1.1 10.16,15.24 11.43,13.97 v45.72,13.97 | v48.26,11.43 48.58,11.11 U$3.P$29
  Bottom 0.203: v45.72,13.97 46.99,13.97 48.26,12.7 v48.26,11.43
TX_LED
  Top 0.203: U$3.P$2 40.31,2.98 20.72,2.98 18.62,5.08 R5.2
UART_RX  (via drill 0.35)
  Top 0.203: J7.4 80.01,3.81 77.47,1.27 54.05,1.27 53.72,0.94 46.05,0.94 44.58,2.41 U$3.P$14
  Top 0.305: U$3.P$14 44.57,5.39 44.36,5.61 43.23,5.61 38.67,10.16 v26.67,10.16
  Bottom 0.305: v26.67,10.16 24.13,12.7 24.13,66.52 17.98,72.67 17.98,83.82 16.51,85.29 J4.03
UART_TX  (via drill 0.35)
  Top 0.203: 40.64,11.43 41.91,12.7 55.88,12.7 59.69,8.89 76.2,8.89 77.47,7.62 J7.3
  Top 0.305: v39.37,68.58 36.83,71.12 28.6,71.12 27.11,72.61 14.19,72.61 11.43,75.37 11.43,77.47 10.49,78.41 R3.2 10.16,81.92 J4.01 | v39.37,12.7 40.64,11.43 41.77,10.3 41.86,10.3 42.08,10.08 U$3.P$3
  Bottom 0.305: v39.37,12.7 v39.37,68.58

### Text on the board
tPlace: H2 | H1 | COAX | EPS | Solar Panel +Z H1 | 5V BUS | PICOLOCK | CIA | SHUTDOWN | Solar Panel +Z H3 | C2 | TEST | XDL MICRO | GND | 3V3_COM | UART_RX | COM_R Anika D. (12/3/2020) | UART_TX